# Altium schematic sheet 智慧大棚.SchDoc
size A3
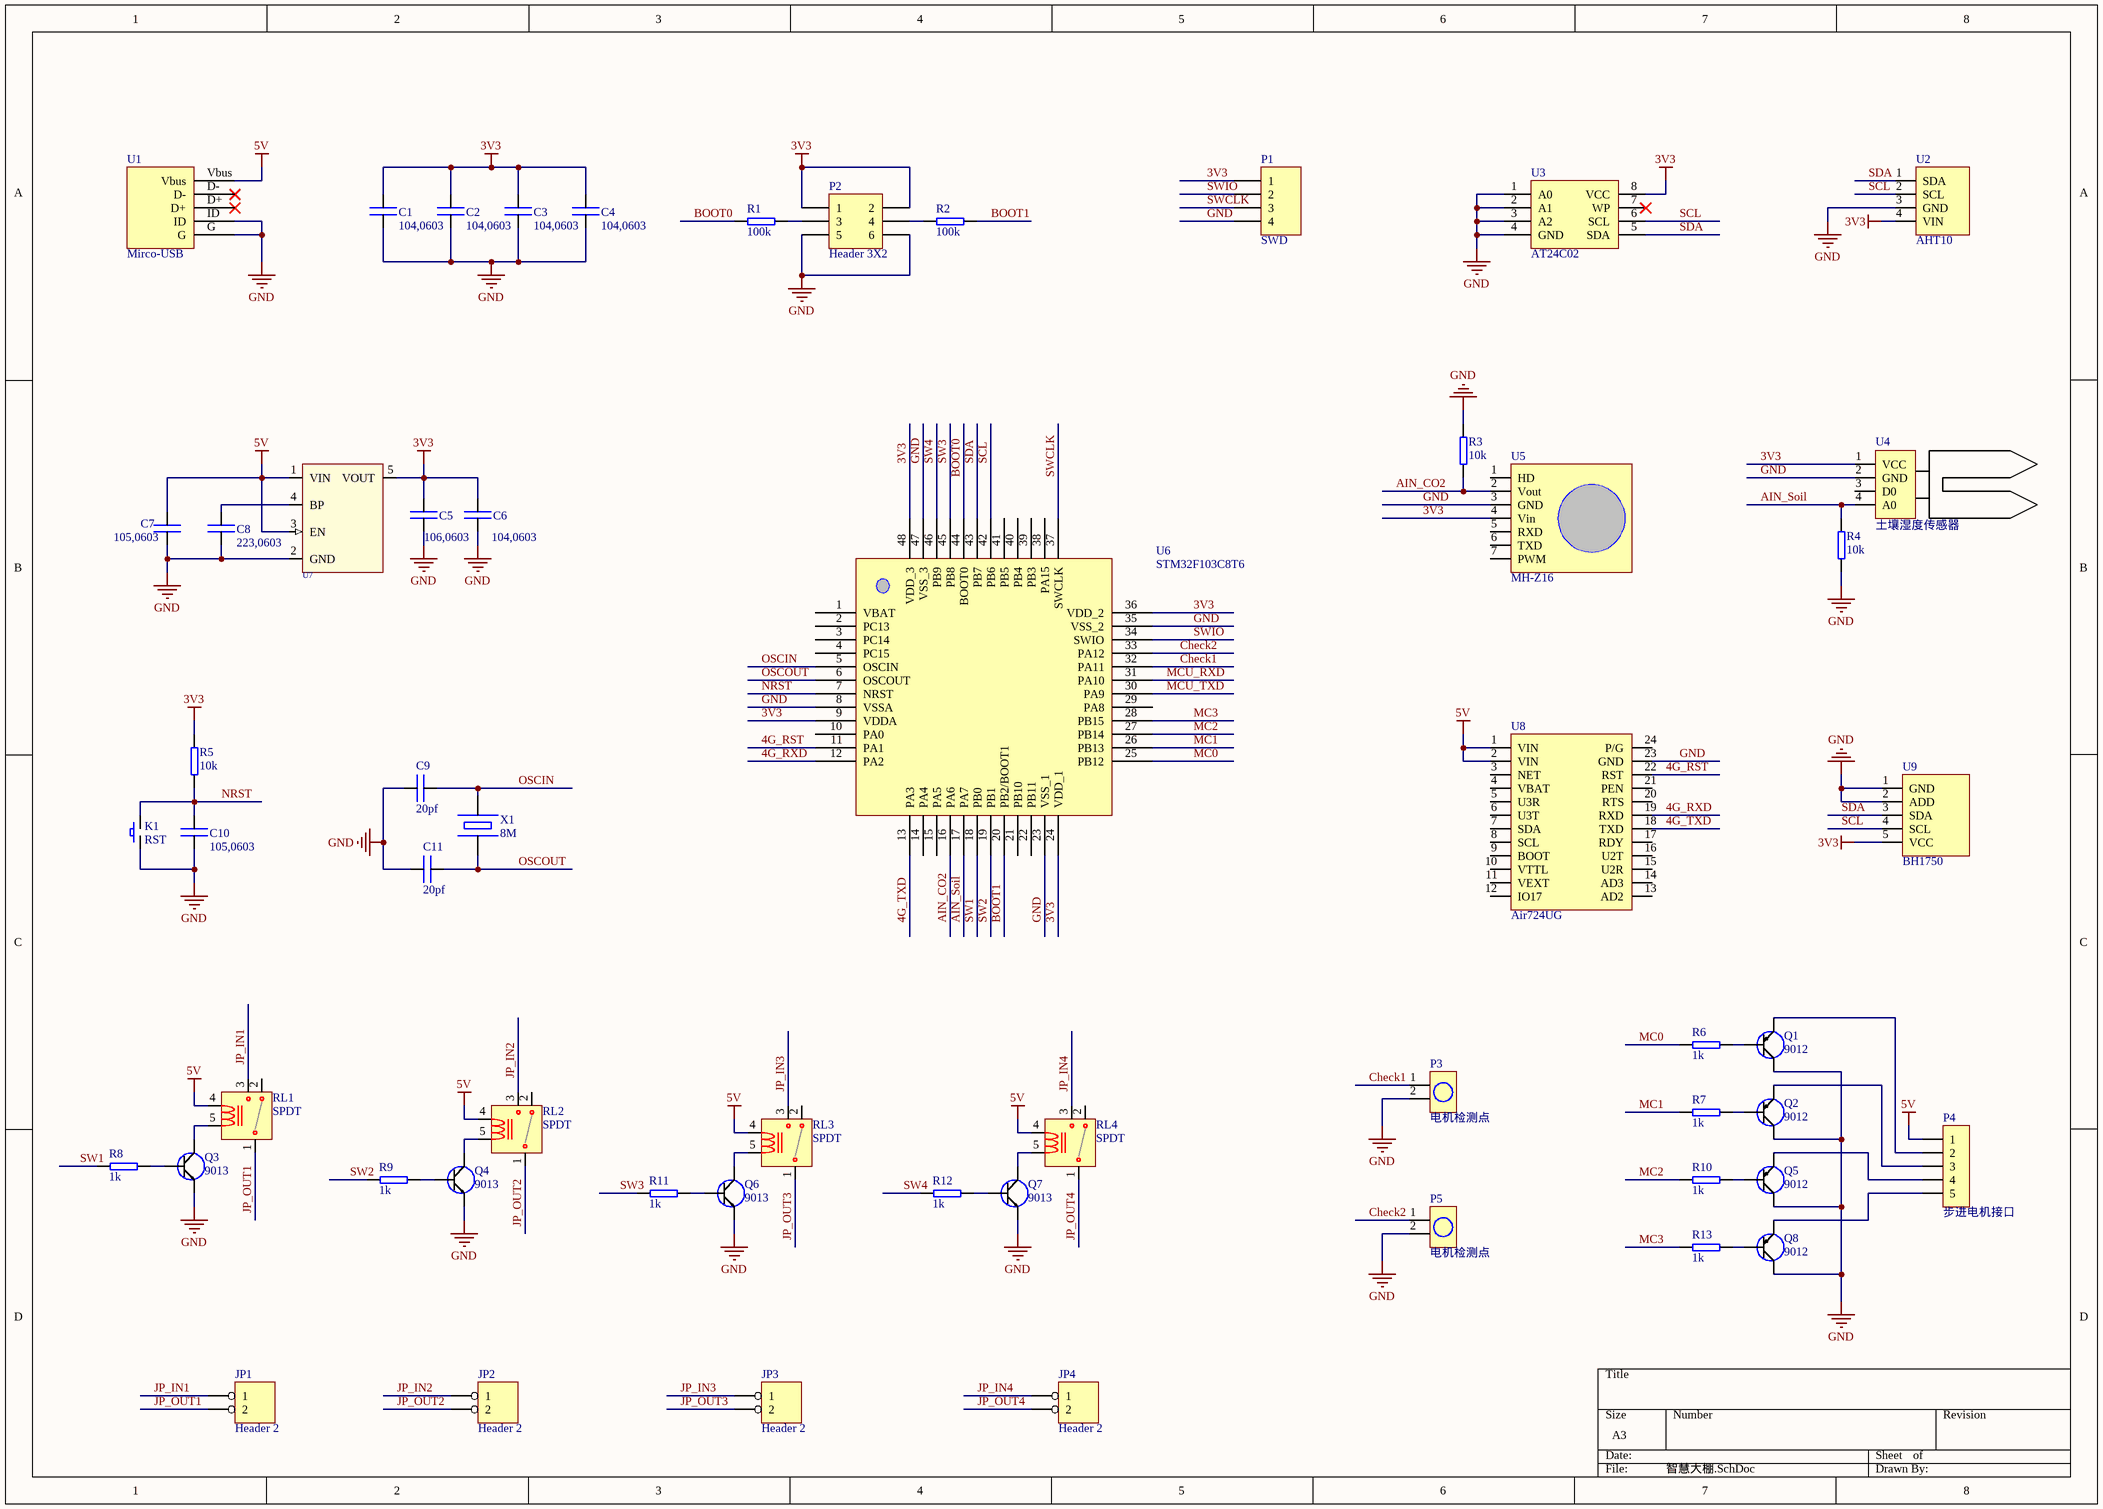
[diagram p0: 智慧大棚.SchDoc]

## Parts
C1  104,0603
C2  104,0603
C3  104,0603
C4  104,0603
C5  106,0603
C6  104,0603
C7  105,0603
C8  223,0603
C9  20pf
C10  105,0603
C11  20pf
JP1  Header 2
JP2  Header 2
JP3  Header 2
JP4  Header 2
K1  RST
P1  SWD  [HDR1X4]
P2  Header 3X2  [HDR2X3]
P3  电机检测点
P4  步进电机接口
P5  电机检测点
Q1  9012
Q2  9012
Q3  9013
Q4  9013
Q5  9012
Q6  9013
Q7  9013
Q8  9012
R1  100k
R2  100k
R3  10k
R4  10k
R5  10k
R6  1k
R7  1k
R8  1k
R9  1k
R10  1k
R11  1k
R12  1k
R13  1k
RL1  SPDT
RL2  SPDT
RL3  SPDT
RL4  SPDT
U1  Mirco-USB  [Micro_USB]
U2  AHT10
U3  AT24C02
U4  土壤湿度传感器
U5  MH-Z16
U6  STM32F103C8T6  [48P]
U7  RT9193  [SOT-23-5]  (value not drawn)
U8  Air724UG
U9  BH1750
X1  8M

## Nets
3V3: C1.1 C2.1 C3.1 C4.1 C5.1 C6.1 P1.1 P2.1 P2.2 R5.2 U2.4(VIN) U3.8(VCC) U4.1(VCC) U5.4(Vin) U6.9(VDDA) U6.24(VDD_1) U6.36(VDD_2) U6.48(VDD_3) U7.5(VOUT) U9.5(VCC)
5V: C7.1 P4.1 RL1.4 RL2.4 RL3.4 RL4.4 U1.Vbus U7.1(VIN) U7.3(EN) U8.1(VIN) U8.2(VIN)
GND: C1.2 C2.2 C3.2 C4.2 C5.2 C6.2 C7.2 C8.2 C9.1 C10.2 C11.1 K1.1 P1.4 P2.5 P2.6 P3.2 P5.2 Q1.2 Q2.2 Q3.2 Q4.2 Q5.2 Q6.2 Q7.2 Q8.2 R3.2 R4.1 U1.G U1.ID U2.3(GND) U3.1(A0) U3.2(A1) U3.3(A2) U3.4(GND) U4.2(GND) U5.3(GND) U6.8(VSSA) U6.23(VSS_1) U6.35(VSS_2) U6.47(VSS_3) U7.2(GND) U8.23(GND) U9.1(GND) U9.2(ADD)
4G_RST: U6.11(PA1) U8.22(RST)
4G_RXD: U6.12(PA2) U8.19(RXD)
4G_TXD: U6.13(PA3) U8.18(TXD)
AIN_CO2: R3.1 U5.2(Vout) U6.16(PA6)
AIN_Soil: R4.2 U4.4(A0) U6.17(PA7)
BOOT0: R1.1 U6.44(BOOT0)
BOOT1: R2.2 U6.20(PB2/BOOT1)
Check1: P3.1 U6.32(PA11)
Check2: P5.1 U6.33(PA12)
JP_IN1: JP1.1 RL1.3
JP_IN2: JP2.1 RL2.3
JP_IN3: JP3.1 RL3.3
JP_IN4: JP4.1 RL4.3
JP_OUT1: JP1.2 RL1.1
JP_OUT2: JP2.2 RL2.1
JP_OUT3: JP3.2 RL3.1
JP_OUT4: JP4.2 RL4.1
MC0: R6.1 U6.25(PB12)
MC1: R7.1 U6.26(PB13)
MC2: R10.1 U6.27(PB14)
MC3: R13.1 U6.28(PB15)
MCU_RXD: U6.31(PA10)
MCU_TXD: U6.30(PA9)
NRST: C10.1 K1.2 R5.1 U6.7(NRST)
OSCIN: C9.2 U6.5(OSCIN) X1.2
OSCOUT: C11.2 U6.6(OSCOUT) X1.1
SCL: U2.2(SCL) U3.6(SCL) U6.42(PB6) U9.4(SCL)
SDA: U2.1(SDA) U3.5(SDA) U6.43(PB7) U9.3(SDA)
SW1: R8.1 U6.18(PB0)
SW2: R9.1 U6.19(PB1)
SW3: R11.1 U6.45(PB8)
SW4: R12.1 U6.46(PB9)
SWCLK: P1.3 U6.37(SWCLK)
SWIO: P1.2 U6.34(SWIO)
NetC8_1: C8.1 U7.4(BP)
NetP2_3: P2.3 R1.2
NetP2_4: P2.4 R2.1
NetP4_2: P4.2 Q1.3
NetP4_3: P4.3 Q2.3
NetP4_4: P4.4 Q5.3
NetP4_5: P4.5 Q8.3
NetQ1_1: Q1.1 R6.2
NetQ2_1: Q2.1 R7.2
NetQ3_1: Q3.1 R8.2
NetQ3_3: Q3.3 RL1.5
NetQ4_1: Q4.1 R9.2
NetQ4_3: Q4.3 RL2.5
NetQ5_1: Q5.1 R10.2
NetQ6_1: Q6.1 R11.2
NetQ6_3: Q6.3 RL3.5
NetQ7_1: Q7.1 R12.2
NetQ7_3: Q7.3 RL4.5
NetQ8_1: Q8.1 R13.2

Not connected (* = marked no-connect by the designer): RL1 2; RL2 2; RL3 2; RL4 2; U1 D+* D-*; U3 7(WP)*; U4 3(D0); U5 1(HD) 5(RXD) 6(TXD) 7(PWM); U6 1(VBAT) 2(PC13) 3(PC14) 4(PC15) 10(PA0) 14(PA4) 15(PA5) 21(PB10) 22(PB11) 29(PA8) 38(PA15) 39(PB3) 40(PB4) 41(PB5); U8 3(NET) 4(VBAT) 5(U3R) 6(U3T) 7(SDA) 8(SCL) 9(BOOT) 10(VTTL) 11(VEXT) 12(IO17) 13(AD2) 14(AD3) 15(U2R) 16(U2T) 17(RDY) 20(RTS) 21(PEN) 24(P/G)

## Library data of the parts
C1-C11 = CAP: 电容
JP1-JP4 = Header 2: 接线端子
K1 = KEY: 微动开关
P1 = Header 4: Header, 4-Pin; LatestRevisionDate: 17-Jul-2002; LatestRevisionNote: Re-released for DXP Platform.; Publisher: Altium Limited
P2 = Header 3X2: Header, 3-Pin, Dual row; LatestRevisionDate: 17-Jul-2002; LatestRevisionNote: Re-released for DXP Platform.; Publisher: Altium Limited
P3 P5 = Header 2IN: 电机位置检测点
P4 = Header 5: Header, 5-Pin
Q1 Q2 Q5 Q8 = PNP: PNP型三极管
R1-R13 = RES: 电阻
U1 = Mirco-USB: Mirco-USB接口
U2 = AHT10: 温湿度传感器
U3 = AT24C02: EEPROM器件
U4 = Soil
U5 = MH-Z16: 二氧化碳传感器
U6 = STM32F103C8T6: MCU 32bit
U7 = RT9193X_5P: 稳压; ICA_MFR_NAME: RICHTEK; ICA_PARTNUM: $$2191094$$RT9193-15CU5; Part Number: TMP-13
U8 = Air724UG: 4G模块
U9 = BH1750: 光照传感器
X1 = CRYSTAL: 晶振